# EAGLE design untitled (EAGLE 9.1.3)
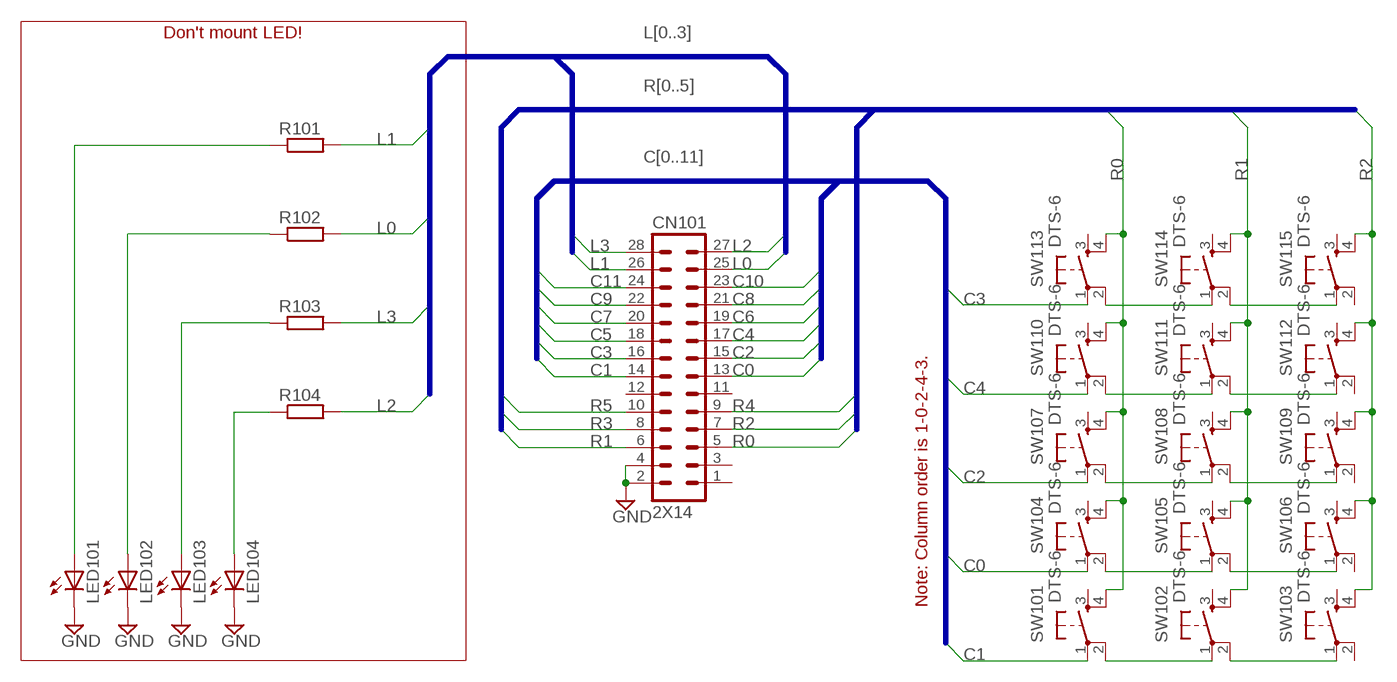
[diagram p0: schematic, sheet 1]

## Parts
CN101  2X14  [2MM_14X2]
LED101  LEDP-LCC-2-BACK  [P-LCC-2-TOPLED-RG]
LED102  LEDP-LCC-2-BACK  [P-LCC-2-TOPLED-RG]
LED103  LEDP-LCC-2-BACK  [P-LCC-2-TOPLED-RG]
LED104  LEDP-LCC-2-BACK  [P-LCC-2-TOPLED-RG]
R101  R-EU_R0402-SS  [R0402-SS]
R102  R-EU_R0402-SS  [R0402-SS]
R103  R-EU_R0402-SS  [R0402-SS]
R104  R-EU_R0402-SS  [R0402-SS]
SW101  DTS-6  [DTS-6]
SW102  DTS-6  [DTS-6]
SW103  DTS-6  [DTS-6]
SW104  DTS-6  [DTS-6]
SW105  DTS-6  [DTS-6]
SW106  DTS-6  [DTS-6]
SW107  DTS-6  [DTS-6]
SW108  DTS-6  [DTS-6]
SW109  DTS-6  [DTS-6]
SW110  DTS-6  [DTS-6]
SW111  DTS-6  [DTS-6]
SW112  DTS-6  [DTS-6]
SW113  DTS-6  [DTS-6]
SW114  DTS-6  [DTS-6]
SW115  DTS-6  [DTS-6]

## Nets
C0: CN101.13 SW104.1
C1: CN101.14 SW101.1
C2: CN101.15 SW107.1
C3: CN101.16 SW113.1
C4: CN101.17 SW110.1
C5: CN101.18
C6: CN101.19
C7: CN101.20
C8: CN101.21
C9: CN101.22
C10: CN101.23
C11: CN101.24
GND: CN101.2 CN101.4 LED101.C LED102.C LED103.C LED104.C
L0: CN101.25 R102.2
L1: CN101.26 R101.2
L2: CN101.27 R104.2
L3: CN101.28 R103.2
N$1: LED101.A R101.1
N$2: SW114.2 SW115.1
N$3: LED102.A R102.1
N$4: SW111.2 SW112.1
N$5: SW108.2 SW109.1
N$7: LED103.A R103.1
N$8: SW102.2 SW103.1
N$9: SW105.2 SW106.1
N$10: LED104.A R104.1
N$11: SW110.2 SW111.1
N$12: SW107.2 SW108.1
N$13: SW104.2 SW105.1
N$14: SW101.2 SW102.1
N$15: SW113.2 SW114.1
R0: CN101.5 SW101.4 SW104.4 SW107.4 SW110.4 SW113.4
R1: CN101.6 SW102.4 SW105.4 SW108.4 SW111.4 SW114.4
R2: CN101.7 SW103.4 SW106.4 SW109.4 SW112.4 SW115.4
R3: CN101.8
R4: CN101.9
R5: CN101.10
Unconnected: CN101.1 CN101.3 CN101.11 CN101.12 SW101.3 SW102.3 SW103.2 SW103.3 SW104.3 SW105.3 SW106.2 SW106.3 SW107.3 SW108.3 SW109.2 SW109.3 SW110.3 SW111.3 SW112.2 SW112.3 SW113.3 SW114.3 SW115.2 SW115.3

## Buses
C[0..11]
R[0..5]
L[0..3]

## Notes on the sheet
- Don't mount LED!
- Note: Column order is 1-0-2-4-3.

## Library data of the parts
CN101 = 4 _ll_ll_:2X14
LED101-LED104 = 8 LED:LED: LED OSRAM: - CHIPLED LG R971, LG N971, LY N971, LG Q971, LY Q971, LO R971, LY R971 LH N974, LH R974 LS Q976, LO Q976, LY Q976 LO Q996 - Hyper CHIPLED LW Q18S LB Q993, LB Q99A, LB R99A - SideLED LS A670, LO A670, LY A670, LG A670, LP A670 LB A673, LV A673, LT A673, LW A673 LH A674 LY A675 LS A676, LA A676, LO A676, LY A676, LW A676 LS A679, LY A679, LG A679 - Hyper Micro SIDELED® LS Y876, LA Y876, LO Y876, LY Y876 LT Y87S - SmartLED LW L88C, LW L88S LB L89C, LB L89S, LG L890 LS L89K, LO L89K, LY L89K LS L896, LA L896, LO L896, LY L896 - TOPLED LS T670, LO T670, LY T670, LG T670, LP T670 LSG T670, LSP T670, LSY T670, LOP T670, LYG T670 LG T671, LOG T671, LSG T671 LB T673, LV T673, LT T673, LW T673 LH T674 LS T676, LA T676, LO T676, LY T676, LB T676, LH T676, LSB T676, LW T676 LB T67C, LV T67C, LT T67C, LS T67K, LO T67K, LY T67K, LW E67C LS E67B, LA E67B, LO E67B, LY E67B, LB E67C, LV E67C, LT E67C LW T67C LS T679, LY T679, LG T679 LS T770, LO T770, LY T770, LG T770, LP T770 LB T773, LV T773, LT T773, LW T773 LH T774 LS E675, LA E675, LY E675, LS T675 LS T776, LA T776, LO T776, LY T776, LB T776 LHGB T686 LT T68C, LB T68C - Hyper Mini TOPLED® LB M676 - Mini TOPLED Santana® LG M470 LS M47K, LO M47K, LY M47K Source: http://www.osram.convergy.de - LUMILED® LXK2-PW12-R00, LXK2-PW12-S00, LXK2-PW14-U00, LXK2-PW14-V00 LXK2-PM12-R00, LXK2-PM12-S00, LXK2-PM14-U00 LXK2-PE12-Q00, LXK2-PE12-R00, LXK2-PE12-S00, LXK2-PE14-T00, LXK2-PE14-U00 LXK2-PB12-K00, LXK2-PB12-L00, LXK2-PB12-M00, LXK2-PB14-N00, LXK2-PB14-P00, LXK2-PB14-Q00 LXK2-PR12-L00, LXK2-PR12-M00, LXK2-PR14-Q00, LXK2-PR14-R00 LXK2-PD12-Q00, LXK2-PD12-R00, LXK2-PD12-S00 LXK2-PH12-R00, LXK2-PH12-S00 LXK2-PL12-P00, LXK2-PL12-Q00, LXK2-PL12-R00 Source: www.luxeon.com
R101-R104 = 2 RCL:R-EU_: RESISTOR, European symbol
SW101-SW115 = 3 switch-tact:DTS-6

## Board
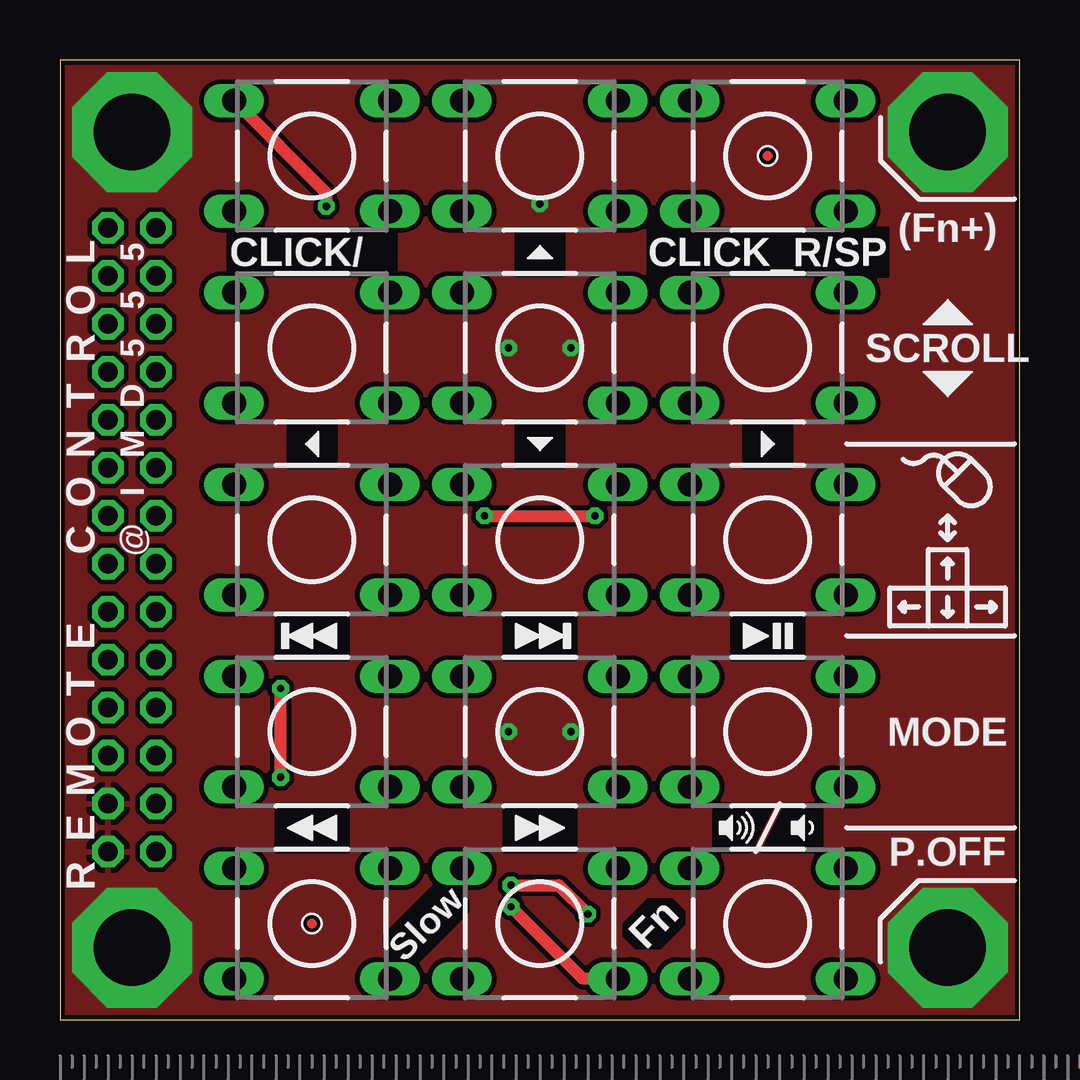
[diagram p1: board, top side]
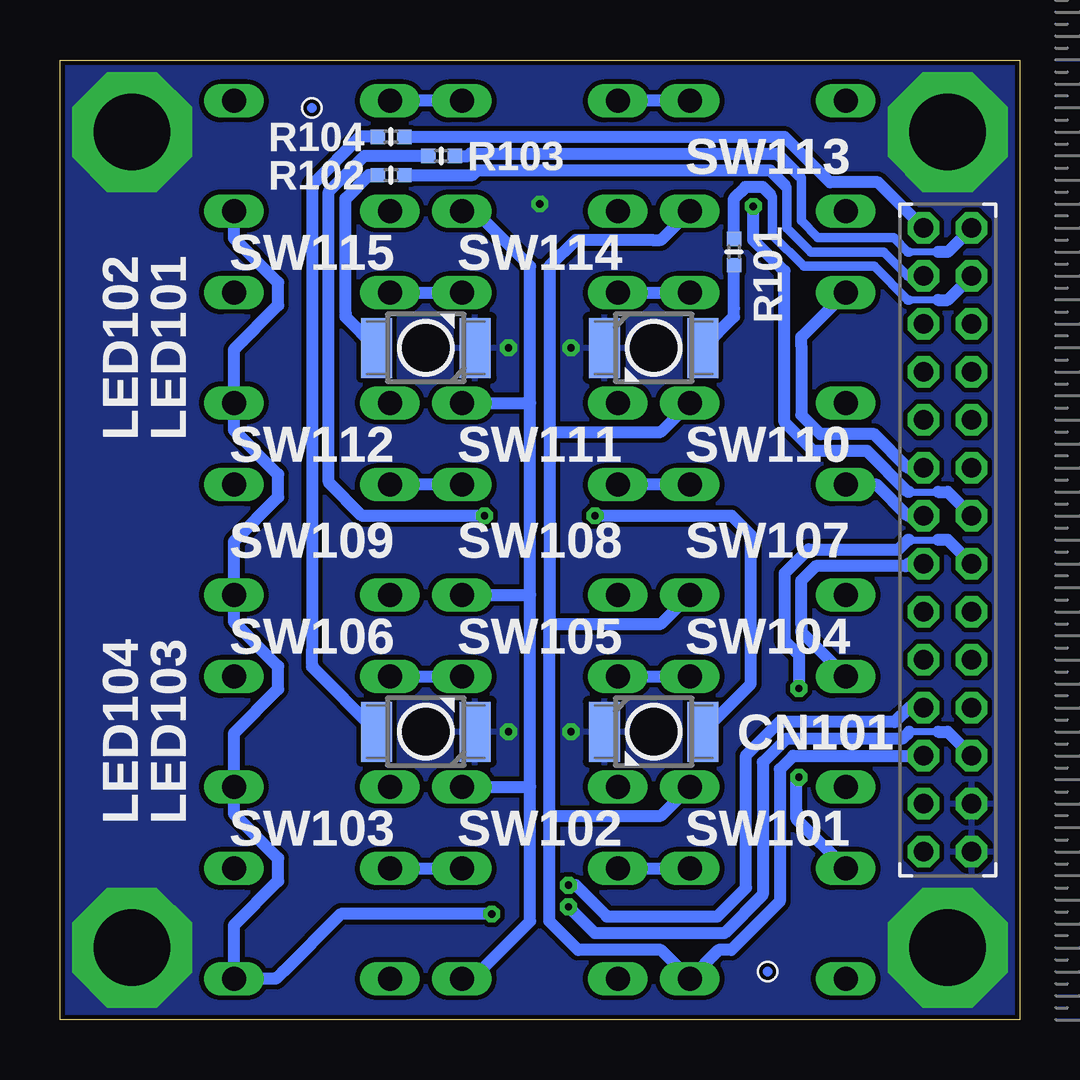
[diagram p2: board, bottom side, seen from below]

Size 40 x 40 mm. Coordinates in mm from the lower left corner, seen from the top.
Outline: 0,0 40,0 40,40 0,40 0,0
Copper layers (1*16): Top 0.035mm / dielectric 1.5mm / Bottom 0.035mm
Design rules "SeeedStudio_2layer_DRU_no_angle_20140221_IMD555 *": minimum track width 0.2mm, minimum drill 0.3mm, track to track 0.2mm, track to pad 0.2mm, pad to pad 0.2mm, via to via 0.2mm, smd to smd 0mil, copper to edge 0.2mm, drill to drill 10mil, minimum pad ring 0.16mm, minimum via ring 0.2mm, stop-mask expansion 0.03mm, vias tented up to drill 5mm, thermal gap 10mil
tRestrict: area 7,31 to 14,33; area 19,31 to 21,33; area 24.5,31 to 34.5,33; area 28.5,23 to 30.5,25; area 19,23 to 21,25; area 9.5,23 to 11.5,25; area 9,15 to 12,17; area 18.5,15 to 21.5,17; area 28,15 to 31,17; area 27.2,7 to 29.8,9; area 18.5,7 to 21.5,9; area 9,7 to 12,9; area 13.5,2.5 to 17,5.5; area 23.5,3 to 26,5; area 29.2,7 to 31.8,9

### Footprints (pad centres in the part's own frame; a part is rotated, then mirrored left to right if it is on the bottom)
2MM_14X2 = drill 0.8 pad 1.3 octagon: 1 13,-1; 2 13,1; 3 11,-1; 4 11,1; 5 9,-1; 6 9,1; 7 7,-1; 8 7,1; 9 5,-1; 10 5,1; 11 3,-1; 12 3,1; 13 1,-1; 14 1,1; 15 -1,-1; 16 -1,1; 17 -3,-1; 18 -3,1; 19 -5,-1; 20 -5,1; 21 -7,-1; 22 -7,1; 23 -9,-1; 24 -9,1; 25 -11,-1; 26 -11,1; 27 -13,-1; 28 -13,1
P-LCC-2-TOPLED-RG = smd 2.5 x 1.3: A 0,2.05; C 0,-2.05
R0402-SS = smd 0.6 x 0.6: 1 -0.55,0; 2 0.55,0
DTS-6 = drill 1 long: 1 -3.25,2.3; 2 3.25,2.3; 3 -3.25,-2.3; 4 3.25,-2.3

### Placement (x,y rotation side)
CN101  3,20 270 bottom
LED101  15.25,28 270 bottom
LED102  24.75,28 90 bottom
LED103  15.25,12 270 bottom
LED104  24.75,12 90 bottom
R101  11.9,32 90 bottom
R102  26.2,35.2 0 bottom
R103  24.1,36 0 bottom
R104  26.2,36.8 0 bottom
SW101  10.5,4 0 top
SW102  20,4 0 top
SW103  29.5,4 0 top
SW104  10.5,12 0 top
SW105  20,12 0 top
SW106  29.5,12 0 top
SW107  10.5,20 0 top
SW108  20,20 0 top
SW109  29.5,20 0 top
SW110  10.5,28 0 top
SW111  20,28 0 top
SW112  29.5,28 0 top
SW113  10.5,36 0 top
SW114  20,36 0 top
SW115  29.5,36 0 top
U$1  [PCB_CHECK]  29.5,36 0 top
U$2  [RULER-S]  0,-4.5 0 top  (outside the outline)
U$3  [RULER-S]  -4.5,0 90 bottom  (outside the outline)
U$4  [PCB_CHECK]  10.5,4 0 top
U$5  [RULER-S]  92,29.5 90 top  (outside the outline)
U$6  [PCB_CHECK]  29.5,38 0 bottom
U$7  [PCB_CHECK]  10.5,2 0 bottom

### Tracks (layer width: path | path; a pad name or v marks a point on that pad's centre or on a via)
C0
  Bottom 0.5: CN101.13 4.65,19 4.75,18.9 8.5,18.9 9.1,18.3 9.1,16.5 9.1,16.2 9.1,16.15 SW104.1
C1  (via drill 0.3 pad 0.7)
  Top 0.5: v9.2,10.1 v9.2,13.8
  Bottom 0.3: 4.6,20 3.4,20
  Bottom 0.5: 3.4,20 3,20 CN101.14 | 4.6,20 4.65,20 5.05,19.6 8.8,19.6 9.8,18.6 9.8,15.8 9.2,15.2 v9.2,13.8 | SW101.1 9.3,8.35 9.3,8.4 9.3,8.7 9.3,10 v9.2,10.1
C2
  Bottom 0.5: CN101.15 4.65,21 5.95,22.3 SW107.1
C3  (via drill 0.3 pad 0.7)
  Top 0.5: v11.1,33.9 11.1,34.3 11.1,34.4 11.1,34.45 SW113.1
  Bottom 0.3: 4.6,22 3.4,22
  Bottom 0.5: CN101.16 3,22 3.4,22 | 4.6,22 4.65,22 6.35,23.7 8.6,23.7 9.8,24.9 9.8,31.2 11.1,32.5 v11.1,33.9
C4
  Bottom 0.5: CN101.17 4.65,23 6.05,24.4 8.3,24.4 9.1,25.2 9.1,28.1 9.1,28.4 9.1,28.45 SW110.1
GND  (via drill 0.3 pad 0.7, 3.2 pad 5)
  other vias: 3,37 37,37 37,3 3,3 21.3,12 18.7,12 18.7,28 21.3,28 20,34
  pour Bottom: 0,40 40,40 40,0 0,0
  pour Top (rank 2): 0,40 40,40 40,0 0,0
L0
  Bottom 0.4: CN101.25 4.65,31 5.65,32 8.7,32 9.7,33 9.7,34.7 9.8,34.8
  Bottom 0.5: 9.8,34.8 10.4,35.4 22.6,35.4 22.8,35.2 R102.2
L1
  Bottom 0.3: 3.4,30 4.6,30
  Bottom 0.4: 4.6,30 4.65,30 6.05,31.4 9,31.4 10.3,32.7 10.3,34.3 10.4,34.4
  Bottom 0.5: CN101.26 3,30 3.4,30 | R101.2 11.9,34.23 11.43,34.7 10.7,34.7 10.4,34.4
L2
  Bottom 0.5: CN101.27 5.9,34.9 7.9,34.9 9.8,36.8 R104.2
L3
  Bottom 0.3: 3.4,32 4.6,32
  Bottom 0.4: 4.6,32 4.65,32 5.25,32.6 8.4,32.6 9.1,33.3 9.1,35.1 9.2,35.2
  Bottom 0.5: CN101.28 3,32 3.4,32 | 9.2,35.2 10,36 10.01,36 10.11,36.1 22.9,36.1 23,36 R103.2
N$1
  Bottom 0.5: LED101.A 11.9,29.3 11.9,29.65 R101.1
N$2
  Bottom 0.5: SW114.2 SW115.1
N$3
  Bottom 0.5: R102.1 27.13,35.2 28.1,34.23 28.1,29.5 28.1,29.35 28.1,29.3 LED102.A
N$4
  Bottom 0.5: SW112.1 SW111.2
N$5
  Bottom 0.5: SW108.2 SW109.1
N$7  (via drill 0.3 pad 0.7)
  Top 0.5: v17.7,21 v22.3,21
  Bottom 0.5: LED103.A 11.2,14 11.2,20.2 12,21 v17.7,21 | v22.3,21 27.4,21 28.8,22.4 28.8,34.52 27.32,36 R103.1
N$8
  Bottom 0.5: SW103.1 SW102.2
N$9
  Bottom 0.5: SW106.1 SW105.2
N$10
  Bottom 0.5: R104.1 27.51,36.8 29.5,34.81 29.5,15.4 29.5,14.85 29.5,14.7 LED104.A
N$11
  Bottom 0.5: SW111.1 SW110.2
N$12
  Bottom 0.5: SW107.2 SW108.1
N$13
  Bottom 0.5: SW105.1 SW104.2
N$14
  Bottom 0.5: SW102.1 SW101.2
N$15
  Bottom 0.5: SW113.2 SW114.1
R0
  Bottom 0.5: 19.6,8.5 19.6,16.5 | 19.6,24.5 19.6,16.5 | SW113.4 14.95,32.5 15,32.5 15.3,32.5 18.5,32.5 19.6,31.4 19.6,24.5 | 19.6,8.5 19.6,4.1 18.4,2.9 14.95,2.9 SW101.4 12.55,2.9 12.02,2.9 10,4.92 10,10.43 9.43,11 CN101.5 | 19.6,8.5 14.95,8.5 SW104.4 | 19.6,16.5 14.95,16.5 SW107.4 | 19.6,24.5 14.95,24.5 SW110.4
R1  (via drill 0.3 pad 0.7)
  Top 0.5: SW102.4 21.8,1.7 21.75,1.75 21.6,1.9 v18.8,4.7
  Bottom 0.3: 3.4,12 4.6,12
  Bottom 0.5: CN101.6 3,12 3.4,12 | SW114.4 22.7,33.7 20.4,31.4 20.4,25.7 | 20.4,9.7 20.4,4.1 22.8,1.7 SW102.4 | 20.4,9.7 20.4,17.7 | 20.4,17.7 20.4,25.7 | SW105.4 20.4,9.7 | SW108.4 20.4,17.7 | SW111.4 20.4,25.7 | 4.6,12 4.9,11.7 9.72,11.7 10.7,10.72 10.7,5.21 12.31,3.6 17.7,3.6 v18.8,4.7
R2  (via drill 0.3 pad 0.7)
  Top 0.5: v18.8,5.6 20.8,5.6 v22,4.4
  Bottom 0.5: SW115.4 32.75,32.58 30.9,30.73 30.9,29.77 32.75,27.92 SW112.4 32.75,24.58 30.9,22.73 30.9,21.77 32.75,19.92 SW109.4 32.75,16.58 30.9,14.73 30.9,13.77 32.75,11.92 SW106.4 32.75,8.58 30.9,6.73 30.9,5.77 32.75,3.92 SW103.4 31,1.7 30.95,1.75 30.7,2 28.3,4.4 v22,4.4 | CN101.7 4.6,13 5.2,12.4 10.01,12.4 11.4,11.01 11.4,5.5 12.6,4.3 17.2,4.3 18.5,5.6 v18.8,5.6

### Text on the board
tPlace: (Fn+) | L | 5 | CLICK/↵ | CLICK_R/SP | O | 5 | 5 | R | 5 | SCROLL | T | D | N | M | O | I | C | @ | E | T | O | MODE | M | E | P.OFF | R | Slow | Fn
_bNames: R104 | SW113 | R103 | R102 | SW114 | SW115 | R101 | LED101 | LED102 | SW110 | SW111 | SW112 | SW107 | SW108 | SW109 | SW104 | SW105 | SW106 | CN101 | LED103 | LED104 | SW101 | SW102 | SW103